# Altium schematic sheet Power.SchDoc
size A4; SheetNumber: 3; SheetTotal: 3
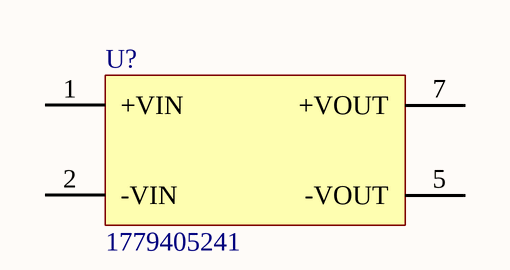
[diagram p0: Power.SchDoc]

## Parts
U?  1779405241  [SIP-7_1779405241]

## Nets

Not connected (* = marked no-connect by the designer): U? 1(+VIN) 2(-VIN) 5(-VOUT) 7(+VOUT)

## Library data of the parts
U? = CMP-013-000028-1: WPME-FISM Fixed Isolated Module, SIP-7, 10.8 - 13.2 Vin, 5 Vout; Manufacturer: Wurth Elektronik; Short Circuit Protection: continuous; Isolation Voltage: 3000 V; Type of Insulation: Functional; Output Power: 2 W; Output Voltage: 5 V; ComponentLink2URL: https://www.we-online.com/redexpert/spec/1779405241?ad; Component Type: Standard; Input Voltage: 10.8 - 13.2 V; Design Item ID: 1779405241; Pin Count: 4; Min Operating Temperature: -40 °C; ComponentLink2Description: Datasheet Link; Max Operating Temperature: 105 °C; Case/Size Code: SIP-7; Width: 7.05 mm; Category: Isolated Converter; ComponentLink1URL: https://www.we-online.com/redexpert/article/1779405241?ad; Source: WPME-FISM.SchLib; Packaging: Tube; Length: 19.65 mm; Match Code: WPME-FISM; Manufacturer Part Number: 1779405241; ComponentLink1Description: Website Link; Height: 10.16 mm; Mount: Through Hole